# Altium project RFID_system.PrjPcb
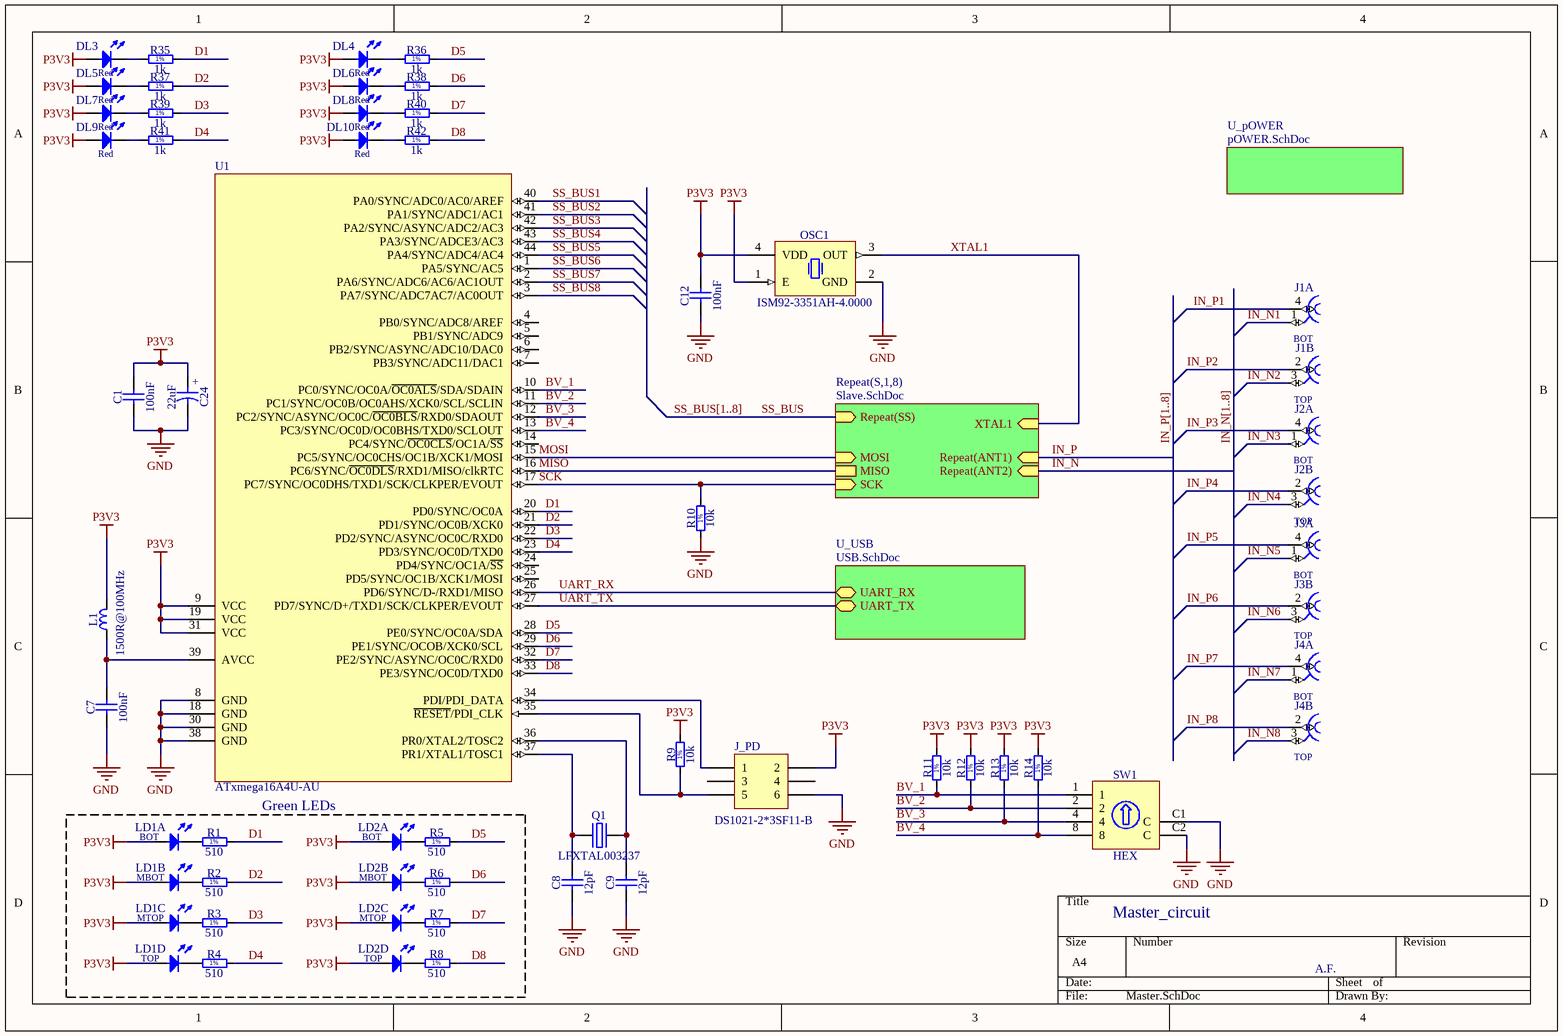
[diagram p0: Master.SchDoc]
4 sheets, 297 parts. Net scope: hierarchical (ports join the sheet entries above them; power ports are global).
Board file: RFID_PCB.PcbDoc
Sheets:
  Master.SchDoc
    S1 = Slave.SchDoc
    S2 = Slave.SchDoc
    S3 = Slave.SchDoc
    S4 = Slave.SchDoc
    S5 = Slave.SchDoc
    S6 = Slave.SchDoc
    S7 = Slave.SchDoc
    S8 = Slave.SchDoc
    U_USB = USB.SchDoc
    U_pOWER = pOWER.SchDoc

## Sheet Master.SchDoc: Master_circuit
size A4; DrawnBy: A.F.; ProjectName: RFID_system

### Parts
C1  100nF  [CAPC1608X87N]
C7  100nF  [CAPC1608X87N]
C8  12pF  [CAPC1608X87N]
C9  12pF  [CAPC1608X87N]
C12  100nF  [CAPC1608X87N]
C24  22uF  [CAPAE430X540N]
DL3  Red  [LED_OSRAM_LSR976]
DL4  Red  [LED_OSRAM_LSR976]
DL5  Red  [LED_OSRAM_LSR976]
DL6  Red  [LED_OSRAM_LSR976]
DL7  Red  [LED_OSRAM_LSR976]
DL8  Red  [LED_OSRAM_LSR976]
DL9  Red  [LED_OSRAM_LSR976]
DL10  Red  [LED_OSRAM_LSR976]
J1  Family  [RENHOTEC_RHT-610-0049]  (value not drawn)  (parts A,B of 2)
J2  Family  [RENHOTEC_RHT-610-0049]  (value not drawn)  (parts A,B of 2)
J3  Family  [RENHOTEC_RHT-610-0049]  (value not drawn)  (parts A,B of 2)
J4  Family  [RENHOTEC_RHT-610-0049]  (value not drawn)  (parts A,B of 2)
J_PD  DS1021-2*3SF11-B  [HDR2X3]
L1  1500R@100MHz  [1608[0603]]
LD1  H485CGDL  [LED_BIVAR_H485CGDL]  (value not drawn)  (parts A,B,C,D of 4)
LD2  H485CGDL  [LED_BIVAR_H485CGDL]  (value not drawn)  (parts A,B,C,D of 4)
OSC1  ISM92-3351AH-4.0000  [OSCSC250P320X500X130-4N]
Q1  LFXTAL003237  [XTAL1160X490X430]
R1  510  [RESC1608X55N]
R2  510  [RESC1608X55N]
R3  510  [RESC1608X55N]
R4  510  [RESC1608X55N]
R5  510  [RESC1608X55N]
R6  510  [RESC1608X55N]
R7  510  [RESC1608X55N]
R8  510  [RESC1608X55N]
R9  10k  [RESC1608X55N]
R10  10k  [RESC1608X55N]
R11  10k  [RESC1608X55N]
R12  10k  [RESC1608X55N]
R13  10k  [RESC1608X55N]
R14  10k  [RESC1608X55N]
R35  1k  [RESC1608X50N]
R36  1k  [RESC1608X50N]
R37  1k  [RESC1608X50N]
R38  1k  [RESC1608X50N]
R39  1k  [RESC1608X50N]
R40  1k  [RESC1608X50N]
R41  1k  [RESC1608X50N]
R42  1k  [RESC1608X50N]
SW1  HEX  [SW_OMRON_A6RV-162RF]
U1  ATxmega16A4U-AU  [44A_N]

### Blocks framed on the sheet
Green LEDs: LD1 LD2 R1-R8

### Sub-sheets
Repeat(S,1,8) = Slave.SchDoc: MOSI (in), MISO, SCK (in), Repeat(SS) (in), Repeat(ANT1) (in), Repeat(ANT2) (in), XTAL1 (in)
U_pOWER = pOWER.SchDoc: no entries
U_USB = USB.SchDoc: UART_RX (bidir), UART_TX (bidir)

### Nets
GND: C1.1 C7.1 C8.1 C9.1 C12.1 C24.2 J_PD.6 OSC1.2(GND) R10.1 SW1.C1(C) SW1.C2(C) U1.8(GND) U1.18(GND) U1.30(GND) U1.38(GND)
P3V3: C1.2 C12.2 C24.1 DL3.2(A) DL4.2(A) DL5.2(A) DL6.2(A) DL7.2(A) DL8.2(A) DL9.2(A) DL10.2(A) J_PD.2 L1.2 LD1.2(A) LD1.4(A) LD1.6(A) LD1.8(A) LD2.2(A) LD2.4(A) LD2.6(A) LD2.8(A) OSC1.1(E) OSC1.4(VDD) R9.2 R11.2 R12.2 R13.2 R14.2 U1.9(VCC) U1.19(VCC) U1.31(VCC)
BV_1: R11.1 SW1.1 U1.10(PC0/SYNC/OC0A/~{OC0ALS}/SDA/SDAIN)
BV_2: R12.1 SW1.2 U1.11(PC1/SYNC/OC0B/OC0AHS/XCK0/SCL/SCLIN)
BV_3: R13.1 SW1.4 U1.12(PC2/SYNC/ASYNC/OC0C/~{OC0BLS}/RXD0/SDAOUT)
BV_4: R14.1 SW1.8 U1.13(PC3/SYNC/OC0D/OC0BHS/TXD0/SCLOUT)
D1: R1.2 R35.1 U1.20(PD0/SYNC/OC0A)
D2: R2.2 R37.1 U1.21(PD1/SYNC/OC0B/XCK0)
D3: R3.2 R39.1 U1.22(PD2/SYNC/ASYNC/OC0C/RXD0)
D4: R4.2 R41.1 U1.23(PD3/SYNC/OC0D/TXD0)
D5: R5.2 R36.1 U1.28(PE0/SYNC/OC0A/SDA)
D6: R6.2 R38.1 U1.29(PE1/SYNC/OCOB/XCK0/SCL)
D7: R7.2 R40.1 U1.32(PE2/SYNC/ASYNC/OC0C/RXD0)
D8: R8.2 R42.1 U1.33(PE3/SYNC/OC0D/TXD0)
IN_N: sheet Repeat(S,1,8)/Repeat(ANT2)
IN_N1: J1.1
IN_N2: J1.3
IN_N3: J2.1
IN_N4: J2.3
IN_N5: J3.1
IN_N6: J3.3
IN_N7: J4.1
IN_N8: J4.3
IN_P: sheet Repeat(S,1,8)/Repeat(ANT1)
IN_P1: J1.4
IN_P2: J1.2
IN_P3: J2.4
IN_P4: J2.2
IN_P5: J3.4
IN_P6: J3.2
IN_P7: J4.4
IN_P8: J4.2
MISO: U1.16(PC6/SYNC/~{OC0DLS}/RXD1/MISO/clkRTC) ; sheet Repeat(S,1,8)/MISO
MOSI: U1.15(PC5/SYNC/OC0CHS/OC1B/XCK1/MOSI) ; sheet Repeat(S,1,8)/MOSI
SCK: R10.2 U1.17(PC7/SYNC/OC0DHS/TXD1/SCK/CLKPER/EVOUT) ; sheet Repeat(S,1,8)/SCK
SS_BUS: sheet Repeat(S,1,8)/Repeat(SS)
SS_BUS1: U1.40(PA0/SYNC/ADC0/AC0/AREF)  [project net SS]
SS_BUS2: U1.41(PA1/SYNC/ADC1/AC1)  [project net SS]
SS_BUS3: U1.42(PA2/SYNC/ASYNC/ADC2/AC3)  [project net SS]
SS_BUS4: U1.43(PA3/SYNC/ADCE3/AC3)  [project net SS]
SS_BUS5: U1.44(PA4/SYNC/ADC4/AC4)  [project net SS]
SS_BUS6: U1.1(PA5/SYNC/AC5)  [project net SS]
SS_BUS7: U1.2(PA6/SYNC/ADC6/AC6/AC1OUT)  [project net SS]
SS_BUS8: U1.3(PA7/SYNC/ADC7AC7/AC0OUT)  [project net SS]
UART_RX: U1.26(PD6/SYNC/D-/RXD1/MISO) ; sheet U_USB/UART_RX
UART_TX: U1.27(PD7/SYNC/D+/TXD1/SCK/CLKPER/EVOUT) ; sheet U_USB/UART_TX
XTAL1: OSC1.3(OUT) ; sheet Repeat(S,1,8)/XTAL1
NetC7_2: C7.2 L1.1 U1.39(AVCC)
NetC8_2: C8.2 Q1.1(OSC1) U1.37(PR1/XTAL1/TOSC1)
NetC9_2: C9.2 Q1.2(OSC2) U1.36(PR0/XTAL2/TOSC2)
NetDL3_1: DL3.1(C) R35.2
NetDL4_1: DL4.1(C) R36.2
NetDL5_1: DL5.1(C) R37.2
NetDL6_1: DL6.1(C) R38.2
NetDL7_1: DL7.1(C) R39.2
NetDL8_1: DL8.1(C) R40.2
NetDL9_1: DL9.1(C) R41.2
NetDL10_1: DL10.1(C) R42.2
NetJ_PD_1: J_PD.1 U1.34(PDI/PDI_DATA)
NetJ_PD_5: J_PD.5 R9.1 U1.35(~{RESET}/PDI_CLK)
NetLD1_1: LD1.1(C) R1.1
NetLD1_3: LD1.3(C) R2.1
NetLD1_5: LD1.5(C) R3.1
NetLD1_7: LD1.7(C) R4.1
NetLD2_1: LD2.1(C) R5.1
NetLD2_3: LD2.3(C) R6.1
NetLD2_5: LD2.5(C) R7.1
NetLD2_7: LD2.7(C) R8.1

Not connected (* = marked no-connect by the designer): J_PD 3 4; U1 4(PB0/SYNC/ADC8/AREF) 5(PB1/SYNC/ADC9) 6(PB2/SYNC/ASYNC/ADC10/DAC0) 7(PB3/SYNC/ADC11/DAC1) 14(PC4/SYNC/~{OC0CLS}/OC1A/~{SS}) 24(PD4/SYNC/OC1A/~{SS}) 25(PD5/SYNC/OC1B/XCK1/MOSI)

### Buses and harness runs
bus IN_N[1..8]
bus IN_P[1..8]
bus SS_BUS[1..8]

### Notes on the sheet
- Labels drawn without touching a wire or pin: \
- (in symbol CAE430-540_22UF_10V_20%) +
- (in symbol CON_BNC_DUAL, part A) BOT
- (in symbol CON_BNC_DUAL, part B) TOP
- (in symbol LED x4 Green 1C2A-BOT_3C4A_5C6A_7C8A-TOP, part A) BOT
- (in symbol LED x4 Green 1C2A-BOT_3C4A_5C6A_7C8A-TOP, part B) MBOT
- (in symbol LED x4 Green 1C2A-BOT_3C4A_5C6A_7C8A-TOP, part C) MTOP
- (in symbol LED x4 Green 1C2A-BOT_3C4A_5C6A_7C8A-TOP, part D) TOP
- (in symbol R0603_10K_1%_0.1W_100PPM) 1%
- (in symbol R0603_510R_1%_0.1W_100PPM) 1%
- (in symbol R0805_1K_1%_0.33W_100PPM_VISHAY_CRCW-HP) 1%

### Library data of the parts
C1 C7 C12 = CC0603_100NF_50V_10%_X5R: Non-polarised capacitor; Part Description: SMD Multilayer Chip Ceramic Capacitor; Manufacturer: GENERIC; Manufacturer1 Part Number: C1608X5R1H104K080AA; Voltage: 50V; TC: X5R; Tolerance: ±10%; Part Number: CC0603_100NF_50V_10%_X5R; Component Kind: Standard; Component Type: Standard; Pin Count: 2; Value: 100nF; Status: None; Manufacturer Part Number: CC0603_100NF_50V_10%_X5R; Case: 0603; Mounted: Yes; Socket: No; SMD: Yes; Sense: No; Manufacturer1 Example: TDK; Manufacturer1 ComponentHeight: 0.9mm; HelpURL: \\cern.ch\dfs\Applications\Altium\Datasheets\CC0603_X5R_TDK_C.pdf; Author: CERN DEM MR; CreateDate: 08.01.2016; LatestRevisionDate: 08.01.2016
C8 C9 = CC0603_12PF_50V_5%_NP0: Non-polarised capacitor; Part Description: SMD Multilayer Chip Ceramic Capacitor; Manufacturer: GENERIC; Manufacturer1 Part Number: 223886715129; Voltage: 50V; TC: C0G/NP0; Tolerance: ±5%; Part Number: CC0603_12PF_50V_5%_NP0; Component Kind: Standard; Component Type: Standard; Pin Count: 2; Value: 12pF; Status: Preferred; Manufacturer Part Number: CC0603_12PF_50V_5%_NP0; Case: 0603; Mounted: Yes; Socket: No; SMD: Yes; Sense: No; Manufacturer1 Example: PHYCOMP; Manufacturer1 ComponentHeight: 0.87mm; HelpURL: \\cern.ch\dfs\Applications\Altium\Datasheets\CC0603_NP0_PHYCOMP.pdf; Author: CERN DEM JLC; CreateDate: 03.12.2007; LatestRevisionDate: 03.12.2007
C24 = CAE430-540_22UF_10V_20%: Polarised capacitor; Part Description: Aluminum Electrolytic SMT Capacitor; Manufacturer: PANASONIC; Manufacturer Part Number: EEEFK1A220AR; Voltage: 10V; Tolerance: ±20%; Part Number: CAE430-540_22UF_10V_20%; Component Kind: Standard; Component Type: Standard; Pin Count: 2; Value: 22uF; Status: Not Recommended; Case: B; Mounted: Yes; Socket: No; SMD: Yes; Sense: No; ComponentHeight: 5.8mm; HelpURL: \\cern.ch\dfs\Applications\Altium\Datasheets\CAE_PANASONIC_FK.pdf; Author: CERN DEM JLC; CreateDate: 2007-12-03; LatestRevisionDate: 2014-11-05
DL3-DL10 = LED_OSRAM_LSR976: LED Red 1C 2A; Part Number: LS R976-NR-1; Part Description: Surface Mount Super Red LED (0805 Case); Manufacturer: OSRAM; Manufacturer Part Number: LSR976; PressFit: No; Bonding: No; Component Kind: Standard; Component Type: Standard; Color: Red; PackageDescription: Super Red Chip LED, 2-Leads, Body 2 x1.25mm, IPC Medium Density; Pin Count: 2; Case: 0805; Mounted: Yes; Socket: No; SMD: Yes; Sense: No; ComponentHeight: 0.9mm; HelpURL: \\cern.ch\dfs\Applications\Altium\Datasheets\LED_OSRAM_LSR976.pdf; Author: CERN DEM JLC; CreateDate: 18.05.2010; LatestRevisionDate: 18.05.2010
J1-J4 = CON_BNC_DUAL: Dual Right Angle 50 Ohm BNC Jack, White Valox Case; Manufacturer: RENHOTEC; Manufacturer Part Number: RHT-610-0049; PressFit: No; Part Number: RENHOTEC_RHT-610-0049; Component Kind: Standard; Component Type: Standard; Pin Count: 6; Family: BNC; Mounted: Yes; Socket: No; SMD: No; Sense: No; Status: None; Part Description: Dual Right Angle 50 Ohm BNC Jack, White Valox Case; ComponentHeight: 29.3mm; HelpURL: \\cern.ch\dfs\Applications\Altium\Datasheets\BOMAR_364A2595.pdf; Author: GK; CreateDate: 09.04.2013; LatestRevisionDate: 09.04.2013
J_PD = Header 3X2: THT Header, 6-Pin, Dual row, 2.54mm pitch; Manufacturer: CONNFLY; LatestRevisionDate: 17-Jul-2002; LatestRevisionNote: Re-released for DXP Platform.; Publisher: Altium Limited; Part Number: DS1021-2*3SF11-B
L1 = IND_1UH_20%_BOURNS_SRP4020TA: Ferrite Bead; Manufacturer: MURATA; Part number: BLM18HE152SN1D; Power: 0.5A; Resistance: 0.5R; Impedence at 100MHZ: 1500R; Footprint: INDC1608X65N; Pin Count: 2; Value: 1500R@100MHz; Status: None; Part Description: Ferrite bead; Mounted: Yes; Socket: No; SMD: Yes; HelpURL: https://www.tme.eu/html/EN/murata-smd-beads/ramka_6596_EN_pelny.html; Author: CERN DEM BC; Producer: Murata
LD1 LD2 = LED x4 Green 1C2A-BOT_3C4A_5C6A_7C8A-TOP: =Part Description; Part Description: Quad-Level 2mm Green LED, PCB Edge Mounting; Manufacturer: BIVAR; Color: Green; PressFit: No; Bonding: No; Part Number: H485CGDL; Component Kind: Standard; Component Type: Standard; PackageDescription: Quad-Level 2mm Green, PCB Edge Mounting  BIVAR H485CHDL; Manufacturer Part Number: H485CGDL; Pin Count: 8; Mounted: Yes; Socket: No; SMD: No; Sense: No; ComponentHeight: 11.3mm; HelpURL: \\cern.ch\dfs\Applications\Altium\Datasheets\LED_BIVAR_H485CGDL.pdf; Author: CERN DEM JLC; CreateDate: 2012-06-04; LatestRevisionDate: 2012-06-04
OSC1 = Oscillator 1E 2GND 3OUT 4VDD: Oscillator 4 pins 3.3V 4MHz; Manufacturer: ILSI; URL: https://www.tme.eu/pl/Document/04fa0ef07f38450711886bdf482cf79c/ISM92_Series.pdf; Part Number: ISM92-3351AH-4.0000
Q1 = XTAL_16MHZ_IQD_LFXTAL003237: =Part Description; Part Description: Tolerance: ± 30ppm, Stability: ± 50ppm, -10°C to +60°C, 16pF, Surface Mount Quartz Crystal, HC49/4HSMX Series; Manufacturer: IQD FREQUENCY PRODUCTS; Value: 16MHz; PressFit: No; Bonding: No; Part Number: LFXTAL003237; Component Kind: Standard; Component Type: Standard; PackageDescription: HC49/4H SMX Case, SMD Cristal, Body 11.6x4.9mm; Manufacturer Part Number: LF XTAL003237; Pin Count: 2; Mounted: Yes; Socket: No; SMD: Yes; Sense: No; ComponentHeight: 4.3mm; HelpURL: \\cern.ch\dfs\Applications\Altium\Datasheets\XTAL_IQD_LFXTAL003237.pdf; Author: CERN DEM MR; CreateDate: 2016-03-23; LatestRevisionDate: 2016-11-07
R1-R8 = R0603_510R_1%_0.1W_100PPM: Resistor - 1%; Part Description: General Purpose Thick Film Chip Resistor; Manufacturer: GENERIC; Manufacturer1 Part Number: NRC06F5100TRF; Power: 0.1W; TC: ±100ppm/°C; PressFit: No; Part Number: R0603_510R_1%_0.1W_100PPM; Component Kind: Standard; Component Type: Standard; Pin Count: 2; Value: 510; Status: Preferred; Tolerance: ±1%; Manufacturer Part Number: R0603_510R_1%_0.1W_100PPM; Case: 0603; Mounted: Yes; Sense: No; Socket: No; SMD: Yes; Manufacturer1 Example: NIC COMPONENT; Manufacturer1 ComponentHeight: 0.55mm; HelpURL: \\cern.ch\dfs\Applications\Altium\Datasheets\R0603_NIC_NRC.pdf; Author: CERN DEM JLC; CreateDate: 2007-12-03; LatestRevisionDate: 2008-03-13
R9-R14 = R0603_10K_1%_0.1W_100PPM: Resistor - 1%; Part Description: General Purpose Thick Film Chip Resistor; Manufacturer: GENERIC; Manufacturer1 Part Number: NRC06F1002TRF; Power: 0.1W; TC: ±100ppm/°C; PressFit: No; Part Number: R0603_10K_1%_0.1W_100PPM; Component Kind: Standard; Component Type: Standard; Pin Count: 2; Value: 10k; Status: Preferred; Tolerance: ±1%; Manufacturer Part Number: R0603_10K_1%_0.1W_100PPM; Case: 0603; Mounted: Yes; Sense: No; Socket: No; SMD: Yes; Manufacturer1 ComponentHeight: 0.55mm; HelpURL: \\cern.ch\dfs\Applications\Altium\Datasheets\R0603_NIC_NRC.pdf; Author: CERN DEM JLC; CreateDate: 03.12.2007; LatestRevisionDate: 13.03.2008; Manufacturer1 Example: NIC COMPONENT
R35-R42 = R0805_1K_1%_0.33W_100PPM_VISHAY_CRCW-HP: Resistor - 1%; Part Description: 150V, Pulse Proof, High Power Thick Film Chip Resistor; Manufacturer: VISHAY DRALORIC; Manufacturer Part Number: CRCW08051K00FKEAHP; Power: 0.33W; TC: ±100ppm/°C; PressFit: No; Part Number: R0805_1K_1%_0.33W_100PPM_VISHAY_CRCW-HP; Component Kind: Standard; Component Type: Standard; Footprint: RESC2012X60N; Pin Count: 2; Value: 1k; Status: None; Tolerance: ±1%; Case: 0805; Mounted: Yes; Sense: No; Socket: No; SMD: Yes; Manufacturer1 ComponentHeight: 0.6mm; HelpURL: \\cern.ch\dfs\Applications\Altium\Datasheets\R0805_VISHAY_CRCW-HP e3.pdf; Author: CERN DEM JLC; CreateDate: 2010-06-16; LatestRevisionDate: 2010-06-16
SW1 = SW_OMRON_A6RV-162RF: Rotary Code Switch 1 2 4 8 C1 C2; Part Number: A6RV-162RF or ERD716RR; Part Description: Side Actuated, Hexadecimal Rotary Code Switch; Manufacturer: OMRON; PressFit: No; Component Kind: Standard; Component Type: Standard; Pin Count: 6; PackageDescription: Body 9.8x6.64mm, Side Actuated, Rotary Code Switch, OMRON A6RV Series; Family: HEX; Mounted: Yes; Socket: No; SMD: No; Sense: No; Status: None; Manufacturer Part Number: A6RV-162RF or ERD716RR; ComponentHeight: 9.9mm; HelpURL: \\cern.ch\dfs\Applications\Altium\Datasheets\SW_OMRON_A6RV.pdf; Author: CERN DEM JLC; CreateDate: 2008-11-27; LatestRevisionDate: 2011-01-19
U1 = ATxmega16A4-AU: 8/16-bit AVR XMEGA A4 Microcontroller, 1.6-3.6V, 16KB + 4KB Flash, 1KB EEPROM, 2KB SRAM, 44-pin TQFP, Industrial Grade (-40°C to 85°C), Pb-Free; Manufacturer: Microchip Technology; Published: 1-Apr-2010; DatasheetVersion: revN, Feb-2010; PackageVersion: rev.B, Oct-2001; PackageReference: 44A; PackageDescription: 44-Pin Plastic Thin Profile Quad Flat Pack, 10 x 10 x 1.0 mm Body, 0.8 mm Pitch (TQFP); ComponentLink1Description: Manufacturer Link; ComponentLink1URL: http://www.atmel.com/products/avr/default.asp?; ComponentLink2Description: ATxmega16A4/32A4/64A4/128A4 Datasheet; ComponentLink2URL: http://www.atmel.com/dyn/resources/prod_documents/doc8069.pdf; ComponentLink3Description: Atmel.com Home; ComponentLink3URL: http://www.atmel.com; Part Number: ATXMEGA16A4-AU; Footprint: TQFP-44

## Sheet Slave.SchDoc: Slave_subcircuit
size A4; DrawnBy: A.F
Used 8 times, as channels S1, S2, S3, S4, S5, S6, S7, S8. Parts and nets are listed once, with the designators drawn on the sheet.
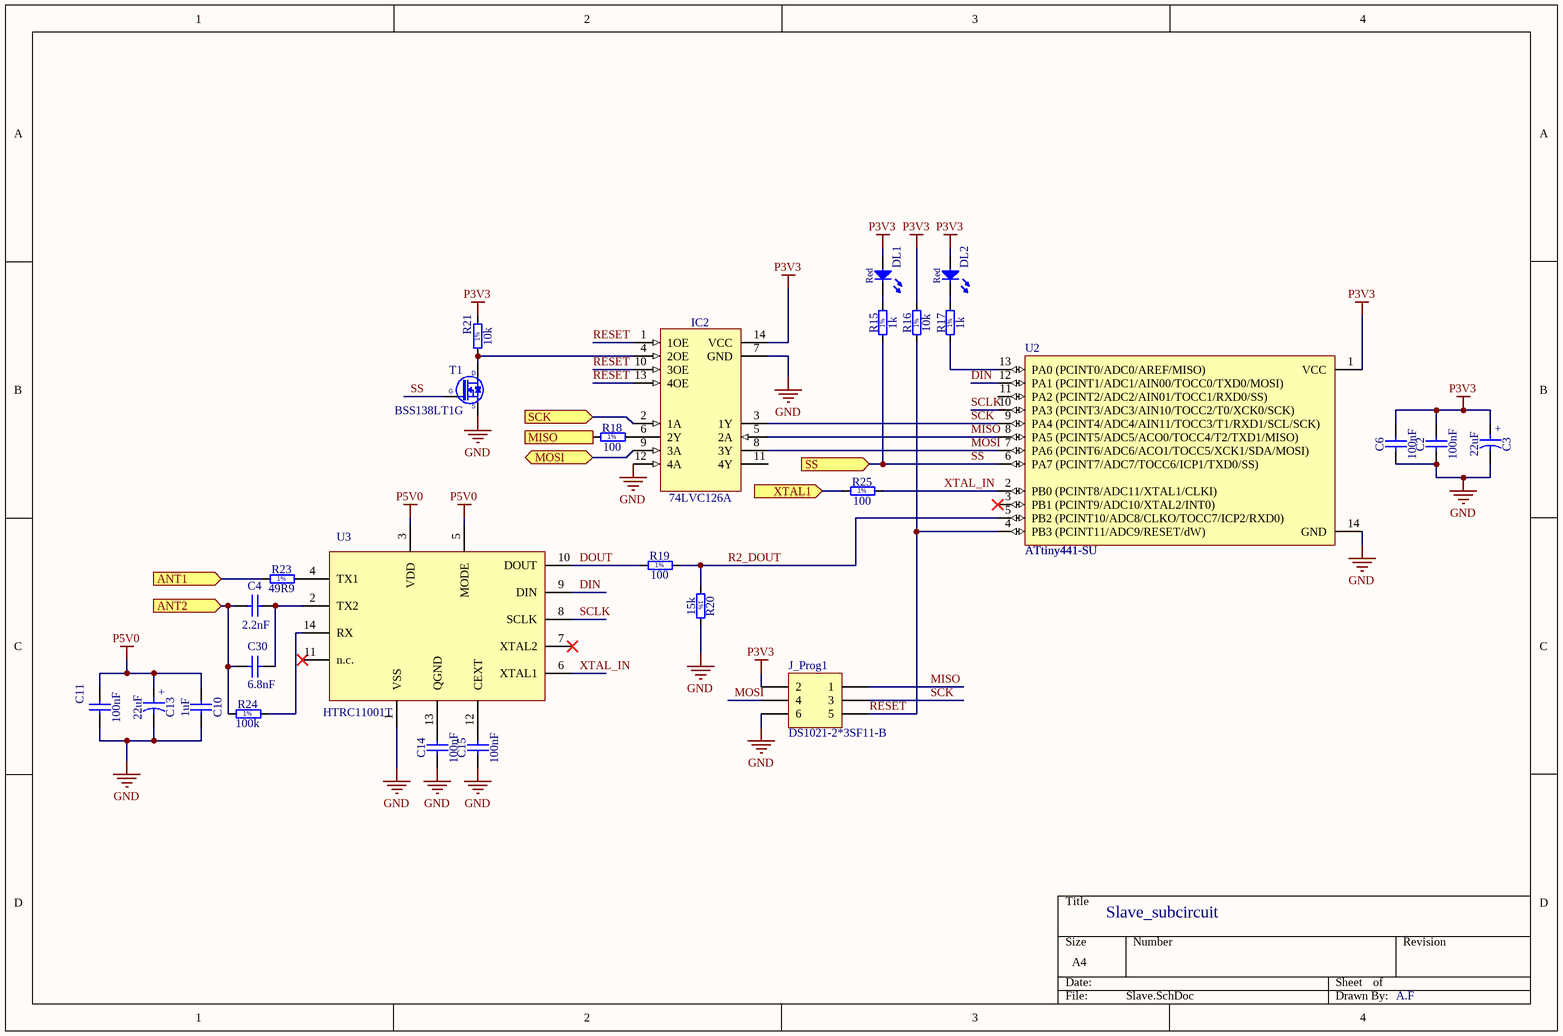
[diagram p1: Slave.SchDoc]

### Parts
C2  100nF  [CAPC1608X87N]
C3  22uF  [CAPAE430X540N]
C4  2.2nF  [CAPC1005X55N]
C6  100nF  [CAPC1608X87N]
C10  1uF  [CAPC1005X55N]
C11  100nF  [CAPC1608X87N]
C13  22uF  [CAPAE430X540N]
C14  100nF  [CAPC1608X87N]
C15  100nF  [CAPC1608X87N]
C30  6.8nF  [CAPC1005X55N]
DL1  Red  [LED_OSRAM_LSR976]
DL2  Red  [LED_OSRAM_LSR976]
IC2  74LVC126A  [SOIC127P600X175-14N]
J_Prog1  DS1021-2*3SF11-B  [HDR2X3]
R15  1k  [RESC1608X50N]
R16  10k  [RESC1608X50N]
R17  1k  [RESC1608X50N]
R18  100  [RESC1005X40N]
R19  100  [RESC1005X40N]
R20  15k  [RESC1608X50N]
R21  10k  [RESC1608X50N]
R23  49R9  [RESC6331X70N]
R24  100k  [RESC1005X40N]
R25  100  [RESC1005X40N]
T1  BSS138LT1G  [SOT95P240X110-3N]
U2  ATtiny441-SU  [14S1_L]
U3  HTRC11001T  [SOIC127P600X175-14N]

### Ports
ANT1 (in), ANT2 (in), MISO (out), MOSI (bidir), SCK (in), SS (in), XTAL1 (in)

### Nets
GND: C2.1 C3.2 C6.1 C10.2 C11.1 C13.2 C14.1 C15.1 IC2.7(GND) IC2.12(4A) J_Prog1.6 R20.2 T1.2(S) U2.14(GND) U3.1(VSS)
P3V3: C2.2 C3.1 C6.2 DL1.2(A) DL2.2(A) IC2.14(VCC) J_Prog1.2 R16.2 R21.2 U2.1(VCC)
P5V0: C10.1 C11.2 C13.1 U3.3(VDD) U3.5(MODE)
ANT1: R23.1 ; port ANT1
ANT2: C4.1 C30.1 R24.1 ; port ANT2
DIN: U2.12(PA1_(PCINT1/ADC1/AIN00/TOCC0/TXD0/MOSI)) U3.9(DIN)
DOUT: R19.1 U3.10(DOUT)
MISO: IC2.5(2A) J_Prog1.1 U2.8(PA5_(PCINT5/ADC5/ACO0/TOCC4/T2/TXD1/MISO))
MISO: R18.1 ; port MISO  [a separate net that carries the same name]
MOSI: IC2.8(3Y) J_Prog1.4 U2.7(PA6_(PCINT6/ADC6/ACO1/TOCC5/XCK1/SDA/MOSI))
MOSI: IC2.9(3A) ; port MOSI  [a separate net that carries the same name]
R2_DOUT: R19.2 R20.1 U2.5(PB2_(PCINT10/ADC8/CLKO/TOCC7/ICP2/RXD0))
RESET: IC2.1(1OE) IC2.10(3OE) IC2.13(4OE) J_Prog1.5 R16.1 U2.4(PB3_(PCINT11/ADC9/RESET/dW))
SCK: IC2.3(1Y) J_Prog1.3 U2.9(PA4_(PCINT4/ADC4/AIN11/TOCC3/T1/RXD1/SCL/SCK))
SCK: IC2.2(1A) ; port SCK  [a separate net that carries the same name]
SCLK: U2.10(PA3_(PCINT3/ADC3/AIN10/TOCC2/T0/XCK0/SCK)) U3.8(SCLK)
SS: R15.1 T1.1(G) U2.6(PA7_(PCINT7/ADC7/TOCC6/ICP1/TXD0/SS)) ; port SS
XTAL1: R25.1 ; port XTAL1
XTAL_IN: R25.2 U2.2(PB0_(PCINT8/ADC11/XTAL1/CLKI)) U3.6(XTAL1)
NetC4_2: C4.2 C30.2 U3.2(TX2)
NetC14_2: C14.2 U3.13(QGND)
NetC15_2: C15.2 U3.12(CEXT)
NetDL1_1: DL1.1(C) R15.2
NetDL2_1: DL2.1(C) R17.2
NetIC2_4: IC2.4(2OE) R21.1 T1.3(D)
NetIC2_6: IC2.6(2Y) R18.2
NetR17_1: R17.1 U2.13(PA0_(PCINT0/ADC0/AREF/MISO))
NetR23_2: R23.2 U3.4(TX1)
NetR24_2: R24.2 U3.14(RX)

Not connected (* = marked no-connect by the designer): IC2 11(4Y); U2 3(PB1_(PCINT9/ADC10/XTAL2/INT0))* 11(PA2_(PCINT2/ADC2/AIN01/TOCC1/RXD0/SS)); U3 7(XTAL2)* 11(n.c.)*

### Channels
S1: designators end in A; ports ANT1=IN_P1 ANT2=IN_N1 MISO=MISO MOSI=MOSI SCK=SCK SS=SS XTAL1=XTAL1
S2: designators end in B; ports ANT1=IN_P2 ANT2=IN_N2 MISO=MISO MOSI=MOSI SCK=SCK SS=SS XTAL1=XTAL1
S3: designators end in C; ports ANT1=IN_P3 ANT2=IN_N3 MISO=MISO MOSI=MOSI SCK=SCK SS=SS XTAL1=XTAL1
S4: designators end in D; ports ANT1=IN_P4 ANT2=IN_N4 MISO=MISO MOSI=MOSI SCK=SCK SS=SS XTAL1=XTAL1
S5: designators end in E; ports ANT1=IN_P5 ANT2=IN_N5 MISO=MISO MOSI=MOSI SCK=SCK SS=SS XTAL1=XTAL1
S6: designators end in F; ports ANT1=IN_P6 ANT2=IN_N6 MISO=MISO MOSI=MOSI SCK=SCK SS=SS XTAL1=XTAL1
S7: designators end in G; ports ANT1=IN_P7 ANT2=IN_N7 MISO=MISO MOSI=MOSI SCK=SCK SS=SS XTAL1=XTAL1
S8: designators end in H; ports ANT1=IN_P8 ANT2=IN_N8 MISO=MISO MOSI=MOSI SCK=SCK SS=SS XTAL1=XTAL1

### Notes on the sheet
- (in symbol CAE430-540_22UF_10V_20%) +
- (in symbol R0402_100K_1%_0.0625W_100PPM) 1%
- (in symbol R0402_100R_1%_0.0625W_100PPM) 1%
- (in symbol R0603_15K_1%_0.1W_100PPM) 1%
- (in symbol R0805_1K_1%_0.33W_100PPM_VISHAY_CRCW-HP) 1%
- (in symbol R2512_49R9_1%_1W_100PPM_VISHAY_CRCW) 1%

### Library data of the parts
C2 C6 C11 C14 C15 = CC0603_100NF_50V_10%_X5R: as C1 on sheet Master; Part Number: CC0603_100NF_50V_10%_X5R; Component Kind: Standard; Component Type: Standard; Pin Count: 2; Value: 100nF; Status: None; Manufacturer Part Number: CC0603_100NF_50V_10%_X5R; Case: 0603; Mounted: Yes; Socket: No; SMD: Yes; Sense: No; Manufacturer1 Example: TDK; Manufacturer1 ComponentHeight: 0.9mm; HelpURL: \\cern.ch\dfs\Applications\Altium\Datasheets\CC0603_X5R_TDK_C.pdf; Author: CERN DEM MR; CreateDate: 08.01.2016; LatestRevisionDate: 08.01.2016
C3 C13 = CAE430-540_22UF_10V_20%: as C24 on sheet Master; Part Number: CAE430-540_22UF_10V_20%; Component Kind: Standard; Component Type: Standard; Pin Count: 2; Value: 22uF; Status: Not Recommended; Case: B; Mounted: Yes; Socket: No; SMD: Yes; Sense: No; ComponentHeight: 5.8mm; HelpURL: \\cern.ch\dfs\Applications\Altium\Datasheets\CAE_PANASONIC_FK.pdf; Author: CERN DEM JLC; CreateDate: 2007-12-03; LatestRevisionDate: 2014-11-05
C4 = CC0402_2.2NF_50V_2%_NP0: Multilayer Ceramic Capacitors MLCC 2200 pF 50VDC 2% 0402 C0G (NP0); Part Number: GRM1555C1H222GA01D; Manufacturer: MURATA
C10 = CC0402_1UF_16V_10%_X5R: Non-polarised capacitor; Part Description: SMD Multilayer Chip Ceramic Capacitor; Manufacturer: GENERIC; Manufacturer1 Part Number: C1005X5R1C105KT; Voltage: 16V; TC: X5R; Tolerance: ±10%; Part Number: CC0402_1UF_16V_10%_X5R; Component Kind: Standard; Component Type: Standard; Pin Count: 2; Value: 1uF; Status: Preferred; Manufacturer Part Number: CC0402_1UF_16V_10%_X5R; Case: 0402; Mounted: Yes; Socket: No; SMD: Yes; Sense: No; Manufacturer1 Example: TDK; Manufacturer1 ComponentHeight: 0.55mm; HelpURL: \\cern.ch\dfs\Applications\Altium\Datasheets\CC0402_X5R_TDK_C.pdf; Author: CERN DEM JLC; CreateDate: 25.10.2012; LatestRevisionDate: 25.10.2012
C30 = CC0402_6.8NF_50V_2%_NP0: Multilayer Ceramic Capacitors MLCC 6800 pF 50VDC 2% 0402 C0G (NP0); Part Number: GRM1555C1H682GE01D; Manufacturer: MURATA
DL1 DL2 = LED_OSRAM_LSR976: =Part Description; Part Number: LS R976-NR-1; Part Description: Surface Mount Super Red LED (0805 Case); Manufacturer: OSRAM; Manufacturer Part Number: LSR976; PressFit: No; Bonding: No; Component Kind: Standard; Component Type: Standard; Color: Red; PackageDescription: Super Red Chip LED, 2-Leads, Body 2 x1.25mm, IPC Medium Density; Pin Count: 2; Case: 0805; Mounted: Yes; Socket: No; SMD: Yes; Sense: No; ComponentHeight: 0.9mm; HelpURL: \\cern.ch\dfs\Applications\Altium\Datasheets\LED_OSRAM_LSR976.pdf; Author: CERN DEM JLC; CreateDate: 18.05.2010; LatestRevisionDate: 18.05.2010
IC2 = 74125: Quadruple Bus Buffer with 3-State Outputs; Manufacturer: TEXAS INSTRUMENTS; PressFit: No; Bonding: No; Part Number: 74LVC126A; Component Kind: Standard; Component Type: Standard; Device: 74LVC126A; PackageDescription: SOIC 14, Pitch 1.27mm - Body 4x8.75mm, IPC Medium Density; Part Description: Quadruple Bus Buffer with 3-State Outputs; Manufacturer Part Number: 74LVC126A; Pin Count: 14; Case: SOIC14; Mounted: Yes; Socket: No; SMD: Yes; Sense: No; ComponentHeight: 1.75mm; Author: CERN DEM JLC; HelpURL: \\cern.ch\dfs\Applications\Altium\Datasheets\SN74HC125D.pdf; CreateDate: 2011-06-30; LatestRevisionDate: 2011-06-30
J_Prog1 = Header 3X2: as J_PD on sheet Master; LatestRevisionDate: 17-Jul-2002; LatestRevisionNote: Re-released for DXP Platform.; Publisher: Altium Limited; Part Number: DS1021-2*3SF11-B
R15 R17 = R0805_1K_1%_0.33W_100PPM_VISHAY_CRCW-HP: as R35 on sheet Master; Part Number: R0805_1K_1%_0.33W_100PPM_VISHAY_CRCW-HP; Component Kind: Standard; Component Type: Standard; Footprint: RESC2012X60N; Pin Count: 2; Value: 1k; Status: None; Tolerance: ±1%; Case: 0805; Mounted: Yes; Sense: No; Socket: No; SMD: Yes; Manufacturer1 ComponentHeight: 0.6mm; HelpURL: \\cern.ch\dfs\Applications\Altium\Datasheets\R0805_VISHAY_CRCW-HP e3.pdf; Author: CERN DEM JLC; CreateDate: 2010-06-16; LatestRevisionDate: 2010-06-16
R16 R21 = R0805_1K_1%_0.33W_100PPM_VISHAY_CRCW-HP: =Part Description; Part Number: CRCW08051K00FKEAHP; Part Description: 150V, Pulse Proof, High Power Thick Film Chip Resistor; Manufacturer: VISHAY DRALORIC; Value: 1k; Power: 0.33W; TC: ±100ppm/°C; Tolerance: ±1%; PressFit: No; Component Kind: Standard; Component Type: Standard; Footprint: RESC2012X60N; Pin Count: 2; Status: None; Manufacturer Part Number: CRCW08051K00FKEAHP; Case: 0805; Mounted: Yes; Sense: No; Socket: No; SMD: Yes; Manufacturer1 ComponentHeight: 0.6mm; HelpURL: \\cern.ch\dfs\Applications\Altium\Datasheets\R0805_VISHAY_CRCW-HP e3.pdf; Author: CERN DEM JLC; CreateDate: 2010-06-16; LatestRevisionDate: 2010-06-16
R18 R19 R25 = R0402_100R_1%_0.0625W_100PPM: Resistor - 1%; Part Description: General Purpose Thick Film Chip Resistor; Manufacturer: GENERIC; Manufacturer1 Part Number: 232270671001L; TC: ±100ppm/°C; PressFit: No; Part Number: R0402_100R_1%_0.0625W_100PPM; Component Kind: Standard; Component Type: Standard; Pin Count: 2; Value: 100; Status: Not Recommended; Power: 0.0625W; Tolerance: ±1%; Manufacturer Part Number: R0402_100R_1%_0.0625W_100PPM; Case: 0402; Mounted: Yes; Sense: No; Socket: No; SMD: Yes; Manufacturer1 Example: YAGEO PHYCOMP; Manufacturer1 ComponentHeight: 0.4mm; HelpURL: \\cern.ch\dfs\Applications\Altium\Datasheets\R0402_Phycomp_RC0402.pdf; Author: CERN DEM JLC; CreateDate: 03.12.2007; LatestRevisionDate: 17.10.2012
R20 = R0603_15K_1%_0.1W_100PPM: Resistor - 1%; Part Description: General Purpose Thick Film Chip Resistor; Manufacturer: GENERIC; Manufacturer1 Part Number: NRC06F1502TRF; Power: 0.1W; TC: ±100ppm/°C; PressFit: No; Part Number: R0603_15K_1%_0.1W_100PPM; Component Kind: Standard; Component Type: Standard; Footprint: RESC1608X55N; Pin Count: 2; Value: 15k; Status: Preferred; Tolerance: ±1%; Manufacturer Part Number: R0603_15K_1%_0.1W_100PPM; Case: 0603; Mounted: Yes; Sense: No; Socket: No; SMD: Yes; Manufacturer1 Example: NIC COMPONENT; Manufacturer1 ComponentHeight: 0.55mm; HelpURL: \\cern.ch\dfs\Applications\Altium\Datasheets\R0603_NIC_NRC.pdf; Author: CERN DEM JMW; CreateDate: 2015-08-17; LatestRevisionDate: 2015-08-17
R23 = R2512_49R9_1%_1W_100PPM_VISHAY_CRCW: Resistor - 1%; Part Number: CRCW251249R9FKEG; Part Description: Thick Film Chip Resistor; Manufacturer: VISHAY DRALORIC; Power: 1W; TC: ±100ppm/°C; PressFit: No; Component Kind: Standard; Component Type: Standard; Pin Count: 2; Value: 49R9; Status: None; Tolerance: ±1%; Manufacturer Part Number: CRCW251249R9FKEG; Case: 2512; Mounted: Yes; Sense: No; Socket: No; SMD: Yes; HelpURL: \\cern.ch\dfs\Applications\Altium\Datasheets\R2512_VISHAY_CRCW2512.pdf; Author: CERN DEM JLC; CreateDate: 22.05.2012; LatestRevisionDate: 22.05.2012; ComponentHeight: 0.7mm
R24 = R0402_100K_1%_0.0625W_100PPM: Resistor - 1%; Part Description: General Purpose Thick Film Chip Resistor; Manufacturer: GENERIC; Manufacturer1 Part Number: 232270671004L; TC: ±100ppm/°C; PressFit: No; Part Number: R0402_100K_1%_0.0625W_100PPM; Component Kind: Standard; Component Type: Standard; Pin Count: 2; Value: 100k; Status: Not Recommended; Power: 0.0625W; Tolerance: ±1%; Manufacturer Part Number: R0402_100K_1%_0.0625W_100PPM; Case: 0402; Mounted: Yes; Sense: No; Socket: No; SMD: Yes; Manufacturer1 Example: YAGEO PHYCOMP; Manufacturer1 ComponentHeight: 0.4mm; HelpURL: \\cern.ch\dfs\Applications\Altium\Datasheets\R0402_Phycomp_RC0402.pdf; Author: CERN DEM JLC; CreateDate: 03.12.2007; LatestRevisionDate: 17.10.2012
T1 = BSS138LT1G: N-CHANNEL MOSFET WITH DIODE; Part Description: 50V 200mA N-Channel Enhancement Mode Field-Effect Transistor; Manufacturer: ON SEMICONDUCTOR; PressFit: No; Bonding: No; Part Number: BSS138LT1G; Component Kind: Standard; Component Type: Standard; Device: BSS138LT1G; PackageDescription: SOT23 3-Leads, Pitch 0.95mm - Body 1.4x3mm, IPC Medium Density; Manufacturer Part Number: BSS138LT1G; Pin Count: 3; Case: SOT23-3; Mounted: Yes; Socket: No; SMD: Yes; Sense: No; ComponentHeight: 1.11mm; HelpURL: \\cern.ch\dfs\Applications\Altium\Datasheets\BSS138LT1G.pdf; Author: CERN DEM JLC; CreateDate: 23.03.2009; LatestRevisionDate: 23.03.2009
U2 = ATtiny441-SU: 8-bit AVR Microcontroller, 1.8-5.5V, 2KB Flash, 128 Bytes SRAM, 12 GPIO pins, 14-pin SOIC, Industrial Grade (-40°C to 85°C), Pb-Free; Manufacturer: Microchip Technology; Published: 1-Apr-2010; DatasheetVersion: revA, Mar-2010; PackageVersion: revA, Feb-2002; PackageReference: 14S1; Publisher: Altium Limited; PackageDescription: 14-Lead, 0.150” Wide Body, Plastic Gull Wing Small Outline Package (SOIC); Code_JEDEC: MS-012-AB; Code_IPC: SOIC127P600-14; ComponentLink1Description: ATtiny20 Datasheet; ComponentLink1URL: http://www.atmel.com/dyn/resources/prod_documents/doc8235.pdf; ComponentLink2Description: ATtiny20 Summary; ComponentLink2URL: http://www.atmel.com/dyn/resources/prod_documents/8235S.pdf; ComponentLink3Description: Atmel.com Home; ComponentLink3URL: http://www.atmel.com; Supplier 1: Digi-Key; Supplier Part Number 1: 1611-ATTINY44-15SSZCT-ND; Part Number: ATtiny441-SU; Footprint: SOIC-14
U3 = HTRC110: HITAG RFID READER 125KHZ; Manufacturer: NXP Semiconductors; Part Number: HTRC11001T/03EE; Footprint: SOIC-14

## Sheet USB.SchDoc
size A4
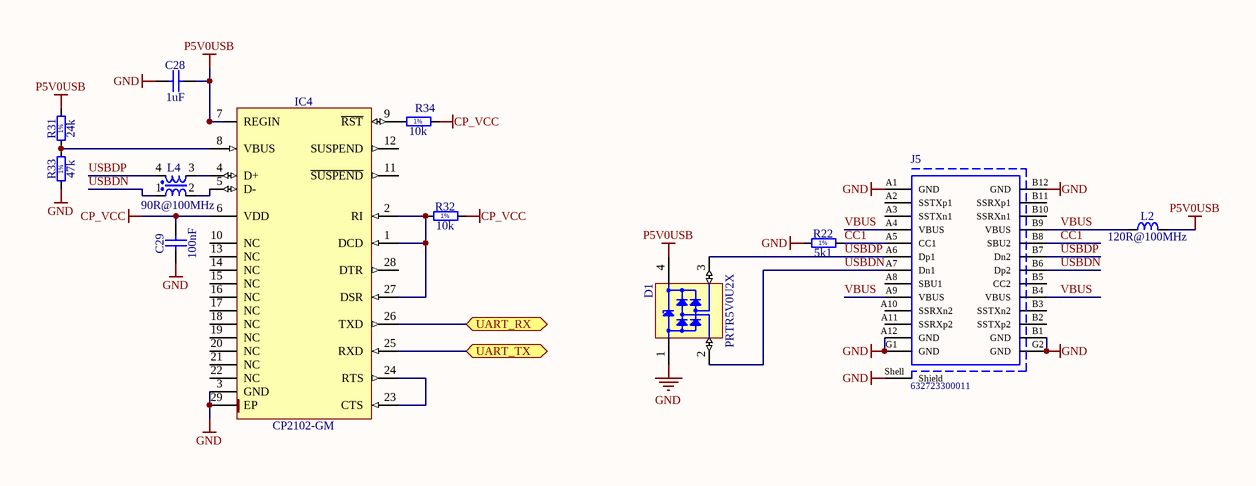
[diagram p2: USB.SchDoc]

### Parts
C28  1uF  [CAPC1005X55N]
C29  100nF  [CAPC1608X87N]
D1  PRTR5V0U2X  [SOT190P230X110-4N]
IC4  CP2102-GM  [QFN50P500X500X100-29N-S335]
J5  632723300011  [632723300011]
L2  120R@100MHz  [INDC1608X65N]
L4  90R@100MHz  [IND_MURATA_DLW21S]
R22  5k1  [RESC1005X40N]
R31  24k  [RESC1005X40N]
R32  10k  [RESC1608X55N]
R33  47k  [RESC1005X40N]
R34  10k  [RESC1608X55N]

### Ports
UART_RX (bidir), UART_TX (bidir)

### Nets
CP_VCC: C29.2 IC4.6(VDD) R32.2 R34.2
GND: C28.1 C29.1 D1.1(GND) IC4.3(GND) IC4.29(EP) J5.A1(GND) J5.A12(GND) J5.B1(GND) J5.B12(GND) J5.G1(GND) J5.G2(GND) J5.Shell(Shield) R22.1 R33.1
P5V0USB: C28.2 D1.4(VCC) IC4.7(REGIN) L2.2 R31.2
CC1: J5.A5(CC1) J5.B8(SBU2) R22.2
UART_RX: IC4.26(TXD) ; port UART_RX
UART_TX: IC4.25(RXD) ; port UART_TX
USBDN: D1.2(I/O1) J5.A7(Dn1) J5.B6(Dp2) L4.1
USBDP: D1.3(I/O2) J5.A6(Dp1) J5.B7(Dn2) L4.4
VBUS: J5.A4(VBUS) J5.A9(VBUS) J5.B4(VBUS) J5.B9(VBUS) L2.1
NetIC4_1: IC4.1(DCD) IC4.2(RI) IC4.27(DSR) R32.1
NetIC4_4: IC4.4(D+) L4.3
NetIC4_5: IC4.5(D-) L4.2
NetIC4_8: IC4.8(VBUS) R31.1 R33.2
NetIC4_9: IC4.9(~{RST}) R34.1
NetIC4_23: IC4.23(CTS) IC4.24(RTS)

Not connected (* = marked no-connect by the designer): IC4 10(NC) 11(~{SUSPEND}) 12(SUSPEND) 13(NC) 14(NC) 15(NC) 16(NC) 17(NC) 18(NC) 19(NC) 20(NC) 21(NC) 22(NC) 28(DTR); J5 A2(SSTXp1) A3(SSTXn1) A8(SBU1) A10(SSRXn2) A11(SSRXp2) B2(SSTXp2) B3(SSTXn2) B5(CC2) B10(SSRXn1) B11(SSRXp1)

### Notes on the sheet
- (in symbol R0402_5K1_1%_0.0625W_100PPM) 1%
- (in symbol R0402_24K_1%_0.0625W_100PPM) 1%
- (in symbol R0402_47K_1%_0.0625W_100PPM) 1%
- (in symbol R0603_10K_1%_0.1W_100PPM) 1%

### Library data of the parts
C28 = CC0402_1UF_16V_10%_X5R: as C10 on sheet Slave; Part Number: CC0402_1UF_16V_10%_X5R; Component Kind: Standard; Component Type: Standard; Pin Count: 2; Value: 1uF; Status: Preferred; Manufacturer Part Number: CC0402_1UF_16V_10%_X5R; Case: 0402; Mounted: Yes; Socket: No; SMD: Yes; Sense: No; Manufacturer1 Example: TDK; Manufacturer1 ComponentHeight: 0.55mm; HelpURL: \\cern.ch\dfs\Applications\Altium\Datasheets\CC0402_X5R_TDK_C.pdf; Author: CERN DEM JLC; CreateDate: 2012-10-25; LatestRevisionDate: 2012-10-25
C29 = CC0603_100NF_50V_10%_X5R: as C1 on sheet Master; Part Number: CC0603_100NF_50V_10%_X5R; Component Kind: Standard; Component Type: Standard; Pin Count: 2; Value: 100nF; Status: None; Manufacturer Part Number: CC0603_100NF_50V_10%_X5R; Case: 0603; Mounted: Yes; Socket: No; SMD: Yes; Sense: No; Manufacturer1 Example: TDK; Manufacturer1 ComponentHeight: 0.9mm; HelpURL: \\cern.ch\dfs\Applications\Altium\Datasheets\CC0603_X5R_TDK_C.pdf; Author: CERN DEM MR; CreateDate: 08.01.2016; LatestRevisionDate: 08.01.2016
D1 = PRTR5V0U2X: Ultra Low Capacitance Double Rail-to-Rail ESD Protection Diode; Part Description: Ultra Low Capacitance (1pF) Double Rail-to-Rail ESD Protection Diode (8kV); Manufacturer: NXP SEMICONDUCTORS; Voltage: 5.5V; PressFit: No; Bonding: No; Part Number: PRTR5V0U2X; Component Kind: Standard; Component Type: Standard; Device: PRTR5V0U2X; PackageDescription: SOT143B, SOT, 1.90mm Pitch; 4 Pin, 1.30mm W X 2.90mm L X 1.10mm H body, IPC Medium Density; Manufacturer Part Number: PRTR5V0U2X; Pin Count: 4; Case: SOT143B; Mounted: Yes; Socket: No; SMD: Yes; Sense: No; ComponentHeight: 1.1mm; HelpURL: \\cern.ch\dfs\Applications\Altium\Datasheets\PRTR5V0U2X.pdf; Author: CERN DEM JLC; CreateDate: 2011-03-22; LatestRevisionDate: 2011-03-22
IC4 = CP2102-GM: Single-Chip USB to UART Bridge; Manufacturer: SILICON LABS; PressFit: No; Bonding: No; Part Number: CP2102-GM; Component Kind: Standard; Component Type: Standard; Device: CP2102-GM; PackageDescription: QFN, 0.50mm Pitch, Square; 28 pin, 5.00mm L X 5.00mm W X 1.00mm H body (w/thermal tab 3.35 X 3.35mm),  IPC Medium Density; Part Description: Single-Chip USB to UART Bridge; Manufacturer Part Number: CP2102-GM; Pin Count: 29; Case: QFN28; Mounted: Yes; Socket: No; SMD: Yes; Sense: No; ComponentHeight: 1.0mm; Author: CERN DEM JLC; HelpURL: \\cern.ch\dfs\Applications\Altium\Datasheets\CP2102-GM.pdf; CreateDate: 03.03.2011; LatestRevisionDate: 03.03.2011
J5 = 632723300011: USB 3.1 Type C Receptacle WR-COM, Horizontal, SMT / THT; Manufacturer: Wurth Elektronik; Rated Current: 5 A; Contact Resistance: 30 mOhm; Working Voltage: 20 VDC; ComponentLink1Description: Manufacturer; ComponentLink1URL: http://www.we-online.de; ComponentLink2Description: Datasheet; ComponentLink2URL: https://katalog.we-online.de/em/datasheet/632723x00011%282%29.pdf; Part Number: 632723300011; Published Date: September 2018; Orientation: Horizontal; Connector Type: USB 3.1 Type C; Operating Temperature: -40 to 105 degC; Mounting Technology: SMT / THT; Gender: Receptacle; Packaging: Tape and Reel
L2 = IND0603_MURATA_BLM18SG121TN1D: Ferrite Bead; Part Description: SMD EMIFIL Suppression Chip Ferrite Bead; Manufacturer: MURATA; Power: 3A; Resistance: 0.025R; Tolerance: ±25%; Table: Inductors SMD; Part Number: BLM18SG121TN1D; Component Kind: Standard; Component Type: Standard; Pin Count: 2; Value: 120R@100MHz; Status: None; Manufacturer Part Number: BLM18SG121TN1D; Case: 0603; Mounted: Yes; Socket: No; SMD: Yes; ComponentHeight: 0.65mm; HelpURL: \\cern.ch\dfs\Applications\Altium\Datasheets\IND0603_MURATA_BLM18S.pdf; Author: CERN DEM JLC; CreateDate: 2014-07-23; LatestRevisionDate: 2014-07-23
L4 = IND_MURATA_DLW21SN900SQ2L: Inductor Common Mode; Part Description: Wire Wound Common Mode Choke Coil (DLW21S Series); Manufacturer: MURATA; Power: 330mA; Resistance: 0.35R; Tolerance: ±25%; Part Number: DLW21SN900SQ2L; Component Kind: Standard; Component Type: Standard; Pin Count: 4; Value: 90R@100MHz; Status: None; Manufacturer Part Number: DLW21SN900SQ2L; Case: 0805; Mounted: Yes; Socket: No; SMD: Yes; Sense: No; ComponentHeight: 1.4mm; HelpURL: \\cern.ch\dfs\Applications\Altium\Datasheets\IND_MURATA_DLW21S.pdf; Author: CERN DEM JLC; CreateDate: 01.07.2014; LatestRevisionDate: 01.07.2014
R22 = R0402_5K1_1%_0.0625W_100PPM: Resistor - 1%; Part Description: General Purpose Thick Film Chip Resistor; Manufacturer: GENERIC; Manufacturer1 Part Number: 232270675102L; TC: ±100ppm/°C; PressFit: No; Part Number: R0402_5K1_1%_0.0625W_100PPM; Component Kind: Standard; Component Type: Standard; Pin Count: 2; Value: 5k1; Status: Not Recommended; Power: 0.0625W; Tolerance: ±1%; Manufacturer Part Number: R0402_5K1_1%_0.0625W_100PPM; Case: 0402; Mounted: Yes; Sense: No; Socket: No; SMD: Yes; Manufacturer1 Example: YAGEO PHYCOMP; Manufacturer1 ComponentHeight: 0.4mm; HelpURL: \\cern.ch\dfs\Applications\Altium\Datasheets\R0402_Phycomp_RC0402.pdf; Author: CERN DEM JLC; CreateDate: 03.12.2007; LatestRevisionDate: 17.10.2012
R31 = R0402_24K_1%_0.0625W_100PPM: Resistor - 1%; Part Description: General Purpose Thick Film Chip Resistor; Manufacturer: GENERIC; Manufacturer1 Part Number: 232270672403L; TC: ±100ppm/°C; Part Number: R0402_24K_1%_0.0625W_100PPM; Component Kind: Standard; Component Type: Standard; Pin Count: 2; Value: 24k; Status: Not recommended; Power: 0.0625W; Tolerance: ±1%; Manufacturer Part Number: R0402_24K_1%_0.0625W_100PPM; Case: 0402; Mounted: Yes; Sense: No; Socket: No; SMD: Yes; Manufacturer1 Example: YAGEO PHYCOMP; Manufacturer1 ComponentHeight: 0.4mm; HelpURL: \\cern.ch\dfs\Applications\Altium\Datasheets\R0402_Phycomp_RC0402.pdf; Author: CERN DEM JLC; CreateDate: 2007-12-03; LatestRevisionDate: 2012-10-17
R32 R34 = R0603_10K_1%_0.1W_100PPM: as R9 on sheet Master; Part Number: R0603_10K_1%_0.1W_100PPM; Component Kind: Standard; Component Type: Standard; Pin Count: 2; Value: 10k; Status: Preferred; Tolerance: ±1%; Manufacturer Part Number: R0603_10K_1%_0.1W_100PPM; Case: 0603; Mounted: Yes; Sense: No; Socket: No; SMD: Yes; Manufacturer1 ComponentHeight: 0.55mm; HelpURL: \\cern.ch\dfs\Applications\Altium\Datasheets\R0603_NIC_NRC.pdf; Author: CERN DEM JLC; CreateDate: 03.12.2007; LatestRevisionDate: 13.03.2008; Manufacturer1 Example: NIC COMPONENT
R33 = R0402_47K_1%_0.0625W_100PPM: Resistor - 1%; Part Description: General Purpose Thick Film Chip Resistor; Manufacturer: GENERIC; Manufacturer1 Part Number: 232270675103L; TC: ±100ppm/°C; Part Number: R0402_47K_1%_0.0625W_100PPM; Component Kind: Standard; Component Type: Standard; Pin Count: 2; Value: 47k; Status: Not recommended; Power: 0.0625W; Tolerance: ±1%; Manufacturer Part Number: R0402_47K_1%_0.0625W_100PPM; Case: 0402; Mounted: Yes; Sense: No; Socket: No; SMD: Yes; Manufacturer1 Example: YAGEO PHYCOMP; Manufacturer1 ComponentHeight: 0.4mm; HelpURL: \\cern.ch\dfs\Applications\Altium\Datasheets\R0402_Phycomp_RC0402.pdf; Author: CERN DEM JLC; CreateDate: 2007-12-03; LatestRevisionDate: 2012-10-17

## Sheet pOWER.SchDoc
size A4
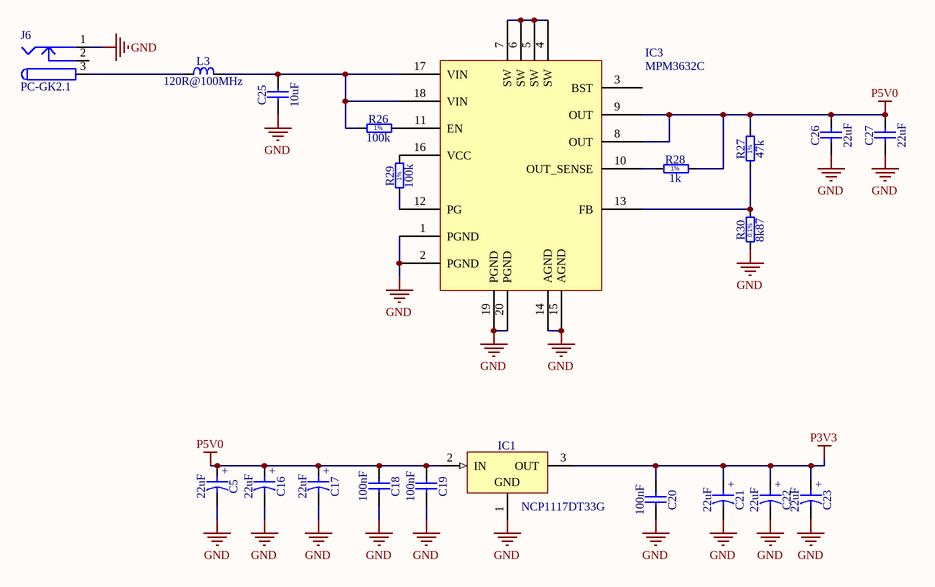
[diagram p3: pOWER.SchDoc]

### Parts
C5  22uF  [CAPAE430X540N]
C16  22uF  [CAPAE430X540N]
C17  22uF  [CAPAE430X540N]
C18  100nF  [CAPC1608X87N]
C19  100nF  [CAPC1608X87N]
C20  100nF  [CAPC1608X87N]
C21  22uF  [CAPAE430X540N]
C22  22uF  [CAPAE430X540N]
C23  22uF  [CAPAE430X540N]
C25  10uF  [CAPC2012X135N]
C26  22uF  [CAPC2012X135N]
C27  22uF  [CAPC2012X135N]
IC1  NCP1117DT33G  [TO228P991X239-3N-R552X520]
IC3  MPM3632C  [PCBComponent_1 - duplicate]
J6  PC-GK2.1  [DC2020]
L3  120R@100MHz  [INDC1608X65N]
R26  100k  [RESC1005X40N]
R27  47k  [RESC1005X40N]
R28  1k  [RESC1608X50N]
R29  100k  [RESC1005X40N]
R30  8k87  [RESC1608X55N]

### Nets
GND: C5.2 C16.2 C17.2 C18.2 C19.2 C20.2 C21.2 C22.2 C23.2 C25.1 C26.1 C27.1 IC1.1(GND) IC3.1(PGND) IC3.2(PGND) IC3.14(AGND) IC3.15(AGND) IC3.19(PGND) IC3.20(PGND) J6.1 R30.1
P3V3: C20.1 C21.1 C22.1 C23.1 IC1.3(OUT)
P5V0: C5.1 C16.1 C17.1 C18.1 C19.1 C26.2 C27.2 IC1.2(IN) IC3.8(OUT) IC3.9(OUT) R27.2 R28.2
NetC25_2: C25.2 IC3.17(VIN) IC3.18(VIN) L3.2 R26.1
NetIC3_4: IC3.4(SW) IC3.5(SW) IC3.6(SW) IC3.7(SW)
NetIC3_10: IC3.10(OUT_SENSE) R28.1
NetIC3_11: IC3.11(EN) R26.2
NetIC3_12: IC3.12(PG) R29.1
NetIC3_13: IC3.13(FB) R27.1 R30.2
NetIC3_16: IC3.16(VCC) R29.2
NetJ6_3: J6.3 L3.1

Not connected (* = marked no-connect by the designer): IC3 3(BST); J6 2

### Notes on the sheet
- (in symbol CAE430-540_22UF_10V_20%) +
- (in symbol R0402_47K_1%_0.0625W_100PPM) 1%
- (in symbol R0402_100K_1%_0.0625W_100PPM) 1%
- (in symbol R0603_8K87_0.1%_0.063W_10PPM) 0.1%
- (in symbol R0805_1K_1%_0.33W_100PPM_VISHAY_CRCW-HP) 1%

### Library data of the parts
C5 C16 C17 C21-C23 = CAE430-540_22UF_10V_20%: as C24 on sheet Master; Part Number: CAE430-540_22UF_10V_20%; Component Kind: Standard; Component Type: Standard; Pin Count: 2; Value: 22uF; Status: Not Recommended; Case: B; Mounted: Yes; Socket: No; SMD: Yes; Sense: No; ComponentHeight: 5.8mm; HelpURL: \\cern.ch\dfs\Applications\Altium\Datasheets\CAE_PANASONIC_FK.pdf; Author: CERN DEM JLC; CreateDate: 2007-12-03; LatestRevisionDate: 2014-11-05
C18-C20 = CC0603_100NF_50V_10%_X5R: as C1 on sheet Master; Part Number: CC0603_100NF_50V_10%_X5R; Component Kind: Standard; Component Type: Standard; Pin Count: 2; Value: 100nF; Status: None; Manufacturer Part Number: CC0603_100NF_50V_10%_X5R; Case: 0603; Mounted: Yes; Socket: No; SMD: Yes; Sense: No; Manufacturer1 Example: TDK; Manufacturer1 ComponentHeight: 0.9mm; HelpURL: \\cern.ch\dfs\Applications\Altium\Datasheets\CC0603_X5R_TDK_C.pdf; Author: CERN DEM MR; CreateDate: 08.01.2016; LatestRevisionDate: 08.01.2016
C25 = CC0805_10UF_16V_10%_X5R: Non-polarised capacitor; Part Description: SMD Multilayer Chip Ceramic Capacitor; Manufacturer: GENERIC; Manufacturer1 Part Number: C0805C106K4PAC; Voltage: 16V; TC: X5R; Tolerance: ±10%; Part Number: CC0805_10UF_16V_10%_X5R; Component Kind: Standard; Component Type: Standard; Pin Count: 2; Value: 10uF; Status: Preferred; Manufacturer Part Number: CC0805_10UF_16V_10%_X5R; Case: 0805; Mounted: Yes; Socket: No; SMD: Yes; Sense: No; Manufacturer1 Example: KEMET; Manufacturer1 ComponentHeight: 1.4mm; HelpURL: \\cern.ch\dfs\Applications\Altium\Datasheets\CC1206_X5R_KEMET.pdf; Author: CERN DEM JLC; CreateDate: 03.12.2007; LatestRevisionDate: 03.12.2007
C26 C27 = CC0805_22UF_16V_10%_X5R: Non-polarised capacitor; Part Description: SMD Multilayer Chip Ceramic Capacitor; Manufacturer: GENERIC; Manufacturer1 Part Number: C2012X5R1C226KT; Voltage: 16V; TC: X5R; Tolerance: ±10%; Part Number: CC0805_22UF_16V_10%_X5R; Component Kind: Standard; Component Type: Standard; Pin Count: 2; Value: 22uF; Status: Preferred; Manufacturer Part Number: CC0805_22UF_16V_10%_X5R; Case: 0805; Mounted: Yes; Socket: No; SMD: Yes; Sense: No; Manufacturer1 Example: TDK; Manufacturer1 ComponentHeight: 1.35mm; HelpURL: \\cern.ch\dfs\Applications\Altium\Datasheets\CC0805_X5R_TDK_C.pdf; Author: CERN DEM JLC; CreateDate: 25.10.2012; LatestRevisionDate: 25.10.2012
IC1 = NCP1117DT33G: 3-Terminal Regulator 1=GND 2=IN 3=OUT; Part Description: 3.3V 1A Low-Dropout Positive Voltage Regulator; Manufacturer: ON SEMICONDUCTOR; PressFit: No; Bonding: No; Part Number: NCP1117DT33G; Component Kind: Standard; Component Type: Standard; Device: NCP1117DT33G; PackageDescription: TO-252AA DPAK TO, 2.28mm pitch; 2 pin,9.905mm L X 6.095mm W X 2.39mm H body, IPC Medium Density; Manufacturer Part Number: NCP1117DT33G; Pin Count: 4; Case: DPAK; Mounted: Yes; Socket: No; SMD: Yes; Sense: No; ComponentHeight: 2.38mm; HelpURL: \\cern.ch\dfs\Applications\Altium\Datasheets\NCP1117DT33G.pdf; Author: CERN DEM JLC; CreateDate: 29.11.2012; LatestRevisionDate: 29.11.2012
IC3 = MPM3632C: Power Management Module 18V 3A Step-Down Regulator Module; Part Number: MPM3632CG; Manufacturer: Monolithic Power Systems (MPS)
J6 = CON_DC_JACK_TH: Power Barrel Connector Jack 2.1mm ID, 5.50mm OD,  Through Hole, Right Angle; Manufacturer: NINIGI; Part Number: PC-GK2.1; Publisher: Altium Limited; Supplier 1: TME; Supplier Part Number 1: PC-GK2.1
L3 = IND0603_MURATA_BLM18SG121TN1D: as L2 on sheet USB; Part Number: BLM18SG121TN1D; Component Kind: Standard; Component Type: Standard; Pin Count: 2; Value: 120R@100MHz; Status: None; Manufacturer Part Number: BLM18SG121TN1D; Case: 0603; Mounted: Yes; Socket: No; SMD: Yes; ComponentHeight: 0.65mm; HelpURL: \\cern.ch\dfs\Applications\Altium\Datasheets\IND0603_MURATA_BLM18S.pdf; Author: CERN DEM JLC; CreateDate: 2014-07-23; LatestRevisionDate: 2014-07-23
R26 R29 = R0402_100K_1%_0.0625W_100PPM: as R24 on sheet Slave; Part Number: R0402_100K_1%_0.0625W_100PPM; Component Kind: Standard; Component Type: Standard; Pin Count: 2; Value: 100k; Status: Not Recommended; Power: 0.0625W; Tolerance: ±1%; Manufacturer Part Number: R0402_100K_1%_0.0625W_100PPM; Case: 0402; Mounted: Yes; Sense: No; Socket: No; SMD: Yes; Manufacturer1 Example: YAGEO PHYCOMP; Manufacturer1 ComponentHeight: 0.4mm; HelpURL: \\cern.ch\dfs\Applications\Altium\Datasheets\R0402_Phycomp_RC0402.pdf; Author: CERN DEM JLC; CreateDate: 03.12.2007; LatestRevisionDate: 17.10.2012
R27 = R0402_47K_1%_0.0625W_100PPM: Resistor - 1%; Part Description: General Purpose Thick Film Chip Resistor; Manufacturer: GENERIC; Manufacturer1 Part Number: 232270675103L; TC: ±100ppm/°C; PressFit: No; Part Number: R0402_47K_1%_0.0625W_100PPM; Component Kind: Standard; Component Type: Standard; Pin Count: 2; Value: 47k; Status: Not Recommended; Power: 0.0625W; Tolerance: ±1%; Manufacturer Part Number: R0402_47K_1%_0.0625W_100PPM; Case: 0402; Mounted: Yes; Sense: No; Socket: No; SMD: Yes; Manufacturer1 Example: YAGEO PHYCOMP; Manufacturer1 ComponentHeight: 0.4mm; HelpURL: \\cern.ch\dfs\Applications\Altium\Datasheets\R0402_Phycomp_RC0402.pdf; Author: CERN DEM JLC; CreateDate: 03.12.2007; LatestRevisionDate: 17.10.2012
R28 = R0805_1K_1%_0.33W_100PPM_VISHAY_CRCW-HP: as R35 on sheet Master; Part Number: R0805_1K_1%_0.33W_100PPM_VISHAY_CRCW-HP; Component Kind: Standard; Component Type: Standard; Footprint: RESC2012X60N; Pin Count: 2; Value: 1k; Status: None; Tolerance: ±1%; Case: 0805; Mounted: Yes; Sense: No; Socket: No; SMD: Yes; Manufacturer1 ComponentHeight: 0.6mm; HelpURL: \\cern.ch\dfs\Applications\Altium\Datasheets\R0805_VISHAY_CRCW-HP e3.pdf; Author: CERN DEM JLC; CreateDate: 2010-06-16; LatestRevisionDate: 2010-06-16
R30 = R0603_8K87_0.1%_0.063W_10PPM: Resistor - 0.1%; Part Description: Thin Film Chip Resistor; Manufacturer: GENERIC; Manufacturer1 Part Number: RN73C1J8K87BTDF; Power: 0.063W; TC: ±10ppm; PressFit: No; Part Number: R0603_8K87_0.1%_0.063W_10PPM; Component Kind: Standard; Component Type: Standard; Pin Count: 2; Value: 8k87; Status: Not Recommended; Tolerance: ±0.1%; Manufacturer Part Number: R0603_8K87_0.1%_0.063W_10PPM; Case: 0603; Mounted: Yes; Sense: No; Socket: No; SMD: Yes; Manufacturer1 Example: TYCO HOLSWORTHY; Manufacturer1 ComponentHeight: 0.5mm; HelpURL: \\cern.ch\dfs\Applications\Altium\Datasheets\R0603_Tyco_RN73.pdf; Author: CERN DEM JLC; CreateDate: 03.12.2007; LatestRevisionDate: 13.03.2008

## Nets that join several sheets
GND: Master (15 pins), S1 (15 pins), S2 (15 pins), S3 (15 pins), S4 (15 pins), S5 (15 pins), S6 (15 pins), S7 (15 pins), S8 (15 pins), USB (14 pins), pOWER (21 pins)
P3V3: Master (31 pins), S1 (10 pins), S2 (10 pins), S3 (10 pins), S4 (10 pins), S5 (10 pins), S6 (10 pins), S7 (10 pins), S8 (10 pins), pOWER (5 pins)
P5V0: S1 (5 pins), S2 (5 pins), S3 (5 pins), S4 (5 pins), S5 (5 pins), S6 (5 pins), S7 (5 pins), S8 (5 pins), pOWER (12 pins)
IN_N1: Master (J1.1), S1 (C4A.1 C30A.1 R24A.1)
IN_N2: Master (J1.3), S2 (C4B.1 C30B.1 R24B.1)
IN_N3: Master (J2.1), S3 (C4C.1 C30C.1 R24C.1)
IN_N4: Master (J2.3), S4 (C4D.1 C30D.1 R24D.1)
IN_N5: Master (J3.1), S5 (C4E.1 C30E.1 R24E.1)
IN_N6: Master (J3.3), S6 (C4F.1 C30F.1 R24F.1)
IN_N7: Master (J4.1), S7 (C4G.1 C30G.1 R24G.1)
IN_N8: Master (J4.3), S8 (C4H.1 C30H.1 R24H.1)
IN_P1: Master (J1.4), S1 (R23A.1)
IN_P2: Master (J1.2), S2 (R23B.1)
IN_P3: Master (J2.4), S3 (R23C.1)
IN_P4: Master (J2.2), S4 (R23D.1)
IN_P5: Master (J3.4), S5 (R23E.1)
IN_P6: Master (J3.2), S6 (R23F.1)
IN_P7: Master (J4.4), S7 (R23G.1)
IN_P8: Master (J4.2), S8 (R23H.1)
MISO: Master (U1.16), S1 (R18A.1), S2 (R18B.1), S3 (R18C.1), S4 (R18D.1), S5 (R18E.1), S6 (R18F.1), S7 (R18G.1), S8 (R18H.1)
MOSI: Master (U1.15), S1 (IC2A.9), S2 (IC2B.9), S3 (IC2C.9), S4 (IC2D.9), S5 (IC2E.9), S6 (IC2F.9), S7 (IC2G.9), S8 (IC2H.9)
SCK: Master (R10.2 U1.17), S1 (IC2A.2), S2 (IC2B.2), S3 (IC2C.2), S4 (IC2D.2), S5 (IC2E.2), S6 (IC2F.2), S7 (IC2G.2), S8 (IC2H.2)
SS: Master (U1.40), S1 (R15A.1 T1A.1 U2A.6)
SS: Master (U1.41), S2 (R15B.1 T1B.1 U2B.6)
SS: Master (U1.42), S3 (R15C.1 T1C.1 U2C.6)
SS: Master (U1.43), S4 (R15D.1 T1D.1 U2D.6)
SS: Master (U1.44), S5 (R15E.1 T1E.1 U2E.6)
SS: Master (U1.1), S6 (R15F.1 T1F.1 U2F.6)
SS: Master (U1.2), S7 (R15G.1 T1G.1 U2G.6)
SS: Master (U1.3), S8 (R15H.1 T1H.1 U2H.6)
UART_RX: Master (U1.26), USB (IC4.26)
UART_TX: Master (U1.27), USB (IC4.25)
XTAL1: Master (OSC1.3), S1 (R25A.1), S2 (R25B.1), S3 (R25C.1), S4 (R25D.1), S5 (R25E.1), S6 (R25F.1), S7 (R25G.1), S8 (R25H.1)

## Assembly variants
Corrects from PCB: alternate parts C7 -> CC0603_100NF_50V_10%_X5R